# Altium schematic sheet LPCB220 - DAC B.SchDoc
size A3; Address1: Factory 10; Address2: 9-13 Dingley Avenue, Dandeong, VICTORIA 3175, AUSTRALIA; DocumentNumber: 7; Revision: 1; SheetNumber: 7; SheetTotal: 18; Lockie__PCB_SUB_ASSEMBLY: DAC B; Lockie__PCB_ASSEMBLY: Brake Control; Lockie__LDL: LPCB220; Lockie__PCB_DESCRIPTION: Redundant Stepper Node
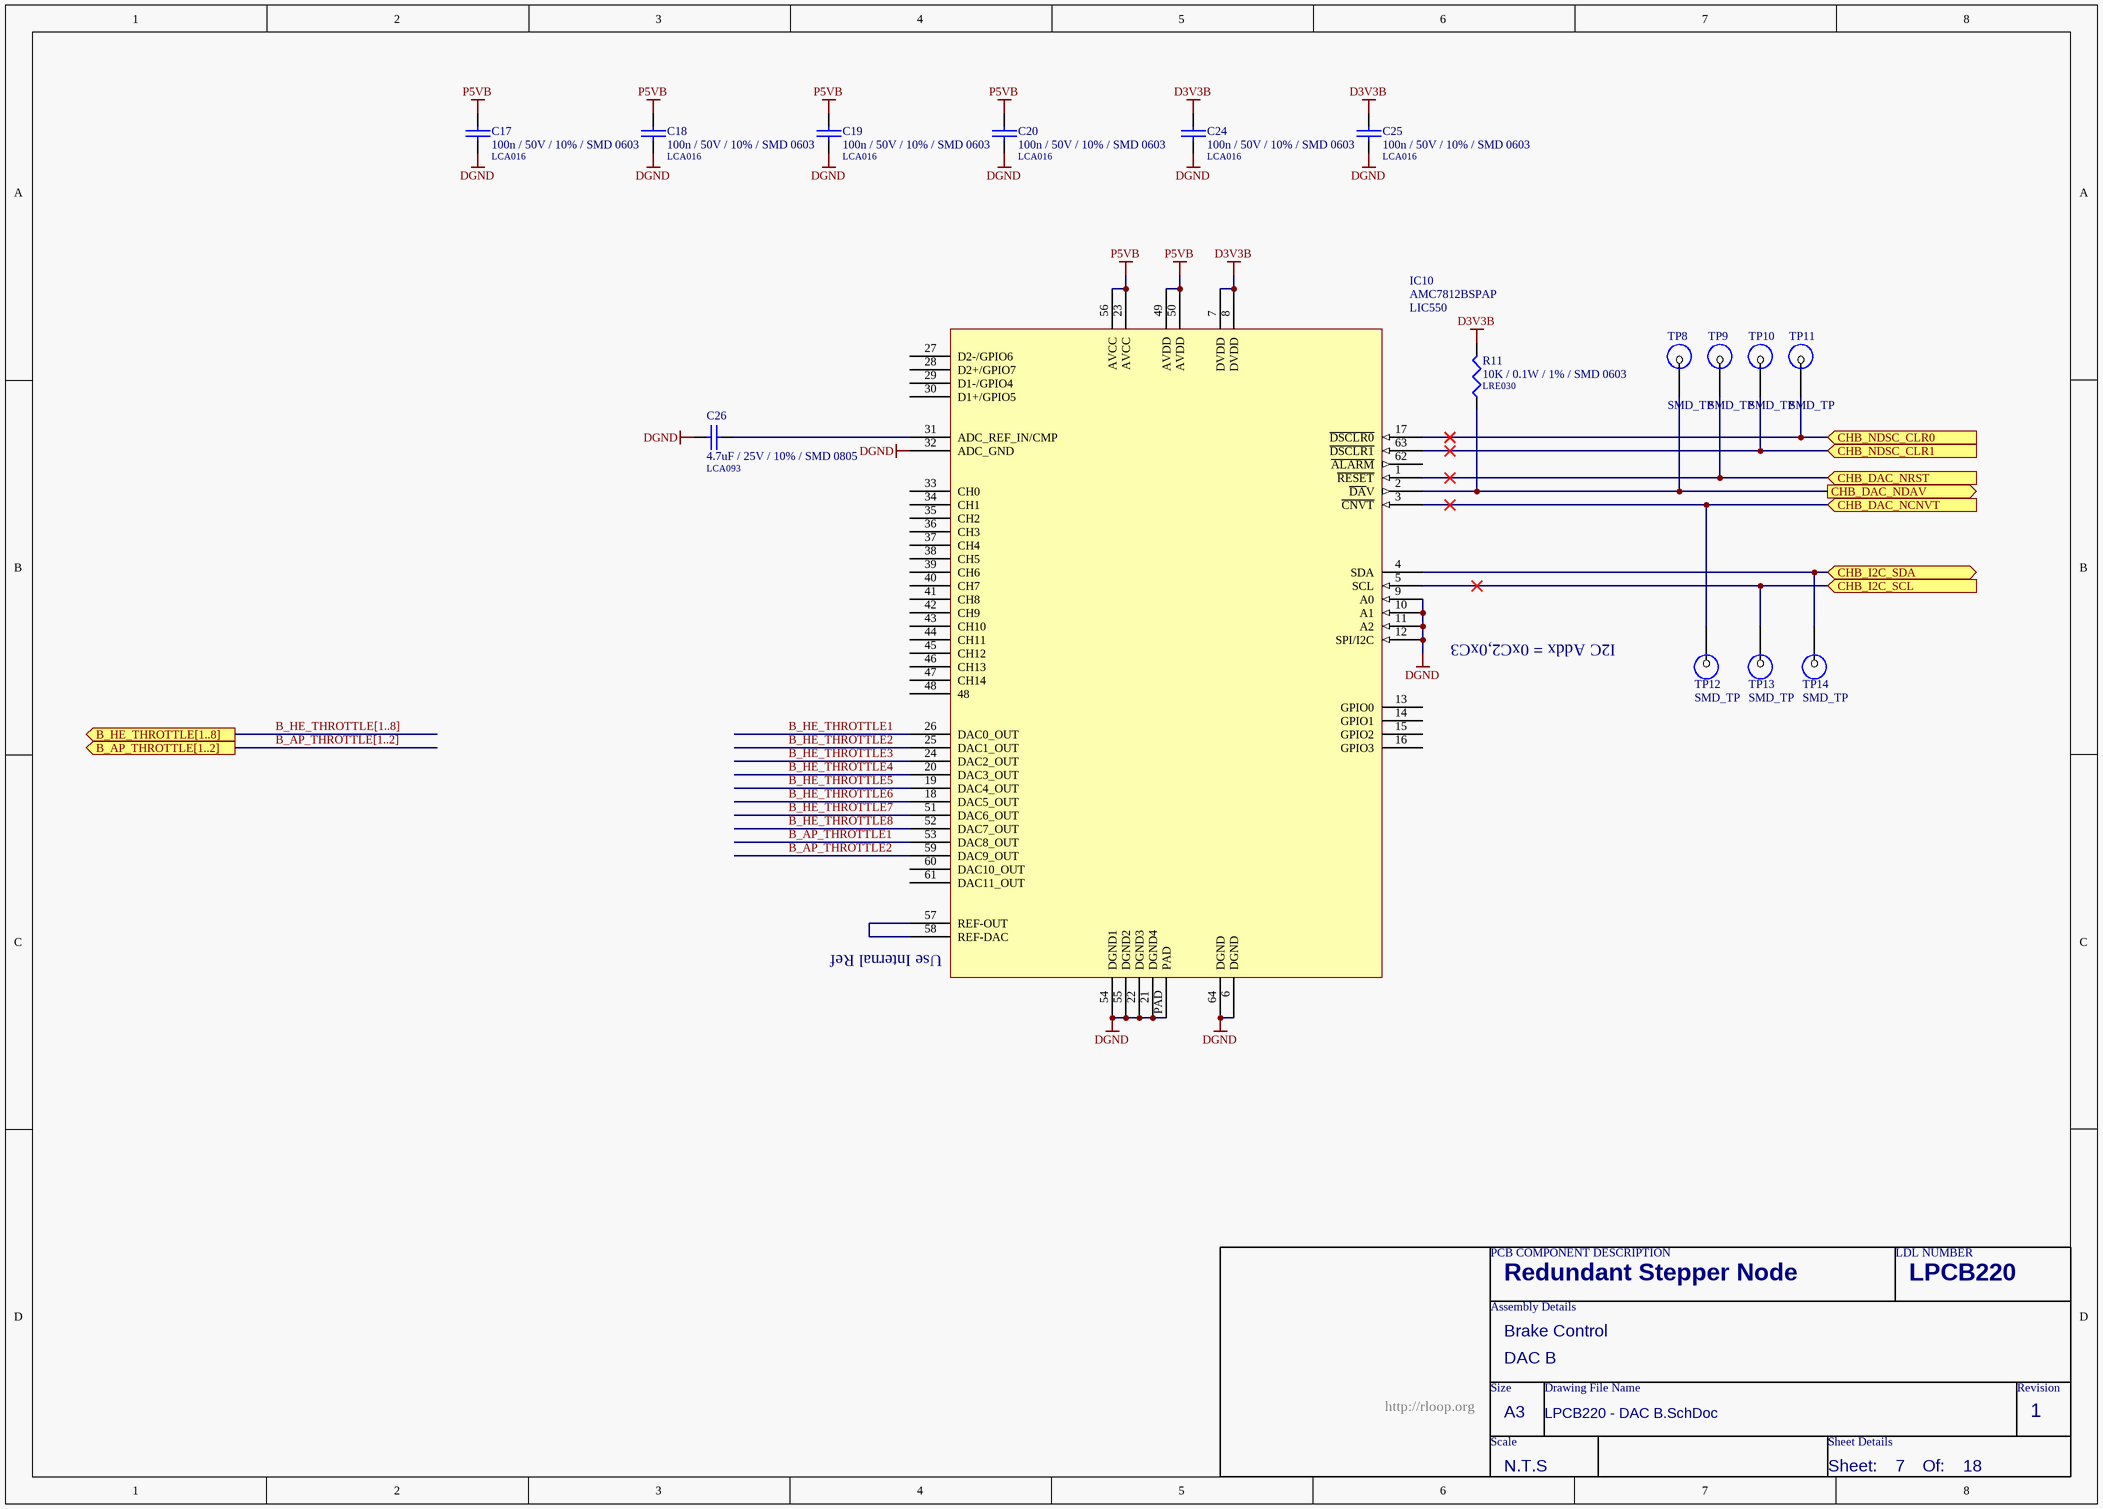
[diagram p0: LPCB220 - DAC B.SchDoc]

## Parts
C17  100n / 50V / 10% / SMD 0603  LDL_NUMBER: LCA016  [LFP011__CC1608-0603-IPC7351_B]
C18  100n / 50V / 10% / SMD 0603  LDL_NUMBER: LCA016  [LFP011__CC1608-0603-IPC7351_B]
C19  100n / 50V / 10% / SMD 0603  LDL_NUMBER: LCA016  [LFP011__CC1608-0603-IPC7351_B]
C20  100n / 50V / 10% / SMD 0603  LDL_NUMBER: LCA016  [LFP011__CC1608-0603-IPC7351_B]
C24  100n / 50V / 10% / SMD 0603  LDL_NUMBER: LCA016  [LFP011__CC1608-0603-IPC7351_B]
C25  100n / 50V / 10% / SMD 0603  LDL_NUMBER: LCA016  [LFP011__CC1608-0603-IPC7351_B]
C26  4.7uF / 25V / 10% / SMD 0805  LDL_NUMBER: LCA093  [LFP010__CC2012-0805-IPC7351_B]
IC10  AMC7812BSPAP  LDL_NUMBER: LIC550  [LFP134__H-QFP10X10-64N]
R11  10K / 0.1W / 1% / SMD 0603  LDL_NUMBER: LRE030  [LFP020__CR1608-0603-IPC7351_B]
TP8  SMD_TP  [SMD-TP]  (no BOM)
TP9  SMD_TP  [SMD-TP]  (no BOM)
TP10  SMD_TP  [SMD-TP]  (no BOM)
TP11  SMD_TP  [SMD-TP]  (no BOM)
TP12  SMD_TP  [SMD-TP]  (no BOM)
TP13  SMD_TP  [SMD-TP]  (no BOM)
TP14  SMD_TP  [SMD-TP]  (no BOM)

## Ports
B_AP_THROTTLE[1..2] (out), B_HE_THROTTLE[1..8] (out), CHB_DAC_NCNVT (in), CHB_DAC_NDAV (out), CHB_DAC_NRST (in), CHB_I2C_SCL (in), CHB_I2C_SDA (bidir), CHB_NDSC_CLR0 (in), CHB_NDSC_CLR1 (in)

## Nets
D3V3B: C24.1 C25.1 IC10.7(DVDD) IC10.8(DVDD) R11.2
DGND: C17.2 C18.2 C19.2 C20.2 C24.2 C25.2 C26.1 IC10.6(DGND) IC10.9(A0) IC10.10(A1) IC10.11(A2) IC10.12(SPI/I2C) IC10.21(DGND4) IC10.22(DGND3) IC10.32(ADC_GND) IC10.54(DGND1) IC10.55(DGND2) IC10.64(DGND) IC10.PAD
P5VB: C17.1 C18.1 C19.1 C20.1 IC10.23(AVCC) IC10.49(AVDD) IC10.50(AVDD) IC10.56(AVCC)
B_AP_THROTTLE1: IC10.53(DAC8_OUT)
B_AP_THROTTLE2: IC10.59(DAC9_OUT)
B_HE_THROTTLE1: IC10.26(DAC0_OUT)
B_HE_THROTTLE2: IC10.25(DAC1_OUT)
B_HE_THROTTLE3: IC10.24(DAC2_OUT)
B_HE_THROTTLE4: IC10.20(DAC3_OUT)
B_HE_THROTTLE5: IC10.19(DAC4_OUT)
B_HE_THROTTLE6: IC10.18(DAC5_OUT)
B_HE_THROTTLE7: IC10.51(DAC6_OUT)
B_HE_THROTTLE8: IC10.52(DAC7_OUT)
CHB_DAC_NCNVT: IC10.3(~{CNVT}) TP12.1 ; port CHB_DAC_NCNVT
CHB_DAC_NDAV: IC10.2(~{DA}V) R11.1 TP8.1 ; port CHB_DAC_NDAV
CHB_DAC_NRST: IC10.1(~{RESET}) TP9.1 ; port CHB_DAC_NRST
CHB_I2C_SCL: IC10.5(SCL) TP13.1 ; port CHB_I2C_SCL
CHB_I2C_SDA: IC10.4(SDA) TP14.1 ; port CHB_I2C_SDA
CHB_NDSC_CLR0: IC10.17(~{DSCLR0}) TP11.1 ; port CHB_NDSC_CLR0
CHB_NDSC_CLR1: IC10.63(~{DSCLR1}) TP10.1 ; port CHB_NDSC_CLR1
NetC26_2: C26.2 IC10.31(ADC_REF_IN/CMP)
NetIC10_57: IC10.57(REF-OUT) IC10.58(REF-DAC)

Not connected (* = marked no-connect by the designer): IC10 13(GPIO0) 14(GPIO1) 15(GPIO2) 16(GPIO3) 27(D2-/GPIO6) 28(D2+/GPIO7) 29(D1-/GPIO4) 30(D1+/GPIO5) 33(CH0) 34(CH1) 35(CH2) 36(CH3) 37(CH4) 38(CH5) 39(CH6) 40(CH7) 41(CH8) 42(CH9) 43(CH10) 44(CH11) 45(CH12) 46(CH13) 47(CH14) 48 60(DAC10_OUT) 61(DAC11_OUT) 62(~{ALARM})

## Buses and harness runs
bus B_AP_THROTTLE[1..2] = port B_AP_THROTTLE[1..2]
bus B_HE_THROTTLE[1..8] = port B_HE_THROTTLE[1..8]

## Notes on the sheet
- I2C Addx = 0xC2,0xC3
- (near IC10) Use Internal Ref
- PCB COMPONENT DESCRIPTION
- LDL NUMBER
- Assembly Details
- Size
- Drawing File Name
- Revision
- http://rloop.org
- Scale
- A3
- Sheet Details
- N.T.S
- Sheet:
- Of:

## Library data of the parts
C17-C20 C24 C25 = 100n / 50V / 10% / SMD 0603: Capacitor, Ceramic Chip, 100nF (0.1uF), 50V, 5%, SMD 0603 [LCA016]; FMEDA__OPERATING__VOLTAGE_MIN: 0; FMEDA__OPERATING__VOLTAGE_MAX: 3.3; FMEDA__OPERATING__TEMP_MIN: -20; FMEDA__OPERATING__TEMP_TYP: 27; FMEDA__OPERATING__TEMP_MAX: 50; FMEDA__CHANNEL: COM; Value: 100n; FMEDA__FUNCTION_IN_SYSTEM: *; FMEDA__OPERATING__VOLTAGE_TYP: 3.3
C26 = 4.7uF / 25V / 10% / SMD 0805: Capacitor, Ceramic Chip, 4.7uF, 25V, 10%, SMD 0805 [LCA093]; Value: 4.7u; FMEDA__OPERATING__TEMP_MAX: 50; FMEDA__OPERATING__TEMP_MIN: -20; FMEDA__OPERATING__TEMP_TYP: 27; FMEDA__OPERATING__VOLTAGE_MAX: 0; FMEDA__CHANNEL: COM; FMEDA__OPERATING__VOLTAGE_MIN: 0; FMEDA__OPERATING__VOLTAGE_TYP: 0; FMEDA__FUNCTION_IN_SYSTEM: *
IC10 = AMC7812BSPAP: IC, ADC / DAC, SMD [LIC550]
R11 = 10K / 0.1W / 1% / SMD 0603: Resistor, Ceramic Chip, 10K, 0.1W, 1%, SMD 0603 [LRE030]; FMEDA__OPERATING__POWER_MAX: 0; FMEDA__OPERATING__TEMP_MAX: 50; FMEDA__OPERATING__TEMP_MIN: -20; FMEDA__OPERATING__TEMP_TYP: 27; FMEDA__CHANNEL: COM; Value: 10K; FMEDA__OPERATING__POWER_MIN: 0; FMEDA__OPERATING__VOLTAGE_MAX: 0; FMEDA__OPERATING__VOLTAGE_MIN: 0; FMEDA__OPERATING__VOLTAGE_TYP: 0; FMEDA__FUNCTION_IN_SYSTEM: *
TP8-TP14 = SMD_TP: SMD Test Point; FMEDA__CHANNEL: COM; FMEDA__OPERATING__CURRENT_MAX: 0; FMEDA__OPERATING__TEMP_MAX: 50; FMEDA__OPERATING__TEMP_MIN: -20; FMEDA__OPERATING__TEMP_TYP: 27; FMEDA__OPERATING__VOLTAGE_MAX: 16; FMEDA__OPERATING__VOLTAGE_TYP: 12; FMEDA__OPERATING__CURRENT_MIN: 0; FMEDA__OPERATING__CURRENT_TYP: 0; FMEDA__OPERATING__VOLTAGE_MIN: 0